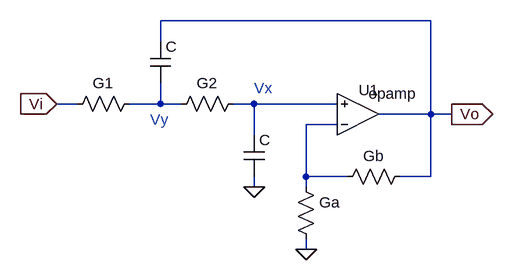
[diagram p0: schematic Draft1.asc]
Draft1.asc, the LTspice schematic file:
Version 4
SHEET 1 880 680
WIRE 416 0 0 0
WIRE 0 32 0 0
WIRE -128 128 -160 128
WIRE 0 128 0 96
WIRE 0 128 -48 128
WIRE 32 128 0 128
WIRE 144 128 112 128
WIRE 272 128 144 128
WIRE 416 144 416 0
WIRE 416 144 336 144
WIRE 448 144 416 144
WIRE 272 160 224 160
WIRE 144 176 144 128
WIRE 224 240 224 160
WIRE 288 240 224 240
WIRE 416 240 416 144
WIRE 416 240 368 240
WIRE 144 256 144 240
WIRE 224 256 224 240
WIRE 224 352 224 336
FLAG -160 128 Vi
IOPIN -160 128 In
FLAG 448 144 Vo
IOPIN 448 144 Out
FLAG 144 256 0
FLAG 224 352 0
SYMBOL OpAmps\\opamp 304 208 M180
WINDOW 0 1 101 Left 2
SYMATTR InstName U1
SYMBOL res -32 112 R90
WINDOW 0 0 56 VBottom 2
WINDOW 3 32 56 VTop 2
SYMATTR InstName G1
SYMATTR Value ""
SYMBOL res 128 112 R90
WINDOW 0 0 56 VBottom 2
WINDOW 3 32 56 VTop 2
SYMATTR InstName G2
SYMATTR Value ""
SYMBOL res 208 240 R0
SYMATTR InstName Ga
SYMATTR Value ""
SYMBOL res 384 224 R90
WINDOW 0 0 56 VBottom 2
WINDOW 3 32 56 VTop 2
SYMATTR InstName Gb
SYMATTR Value ""
SYMBOL cap 128 176 R0
SYMATTR InstName C
SYMATTR Value ""
SYMBOL cap -16 32 R0
SYMATTR InstName C
SYMATTR Value ""
TEXT 144 104 Left 2 ;Vx
TEXT -16 152 Left 2 ;Vy

The netlist it stands for:
* Draft1.asc
XU1 N003 N002 Vo opamp Aol=100K GBW=10Meg  ; pins invin noninvin out
R§G1 N001 Vi
R§G2 N002 N001
R§Ga N003 0
R§Gb Vo N003
C N002 0
C Vo N001
* Vx
* Vy
.backanno
.end